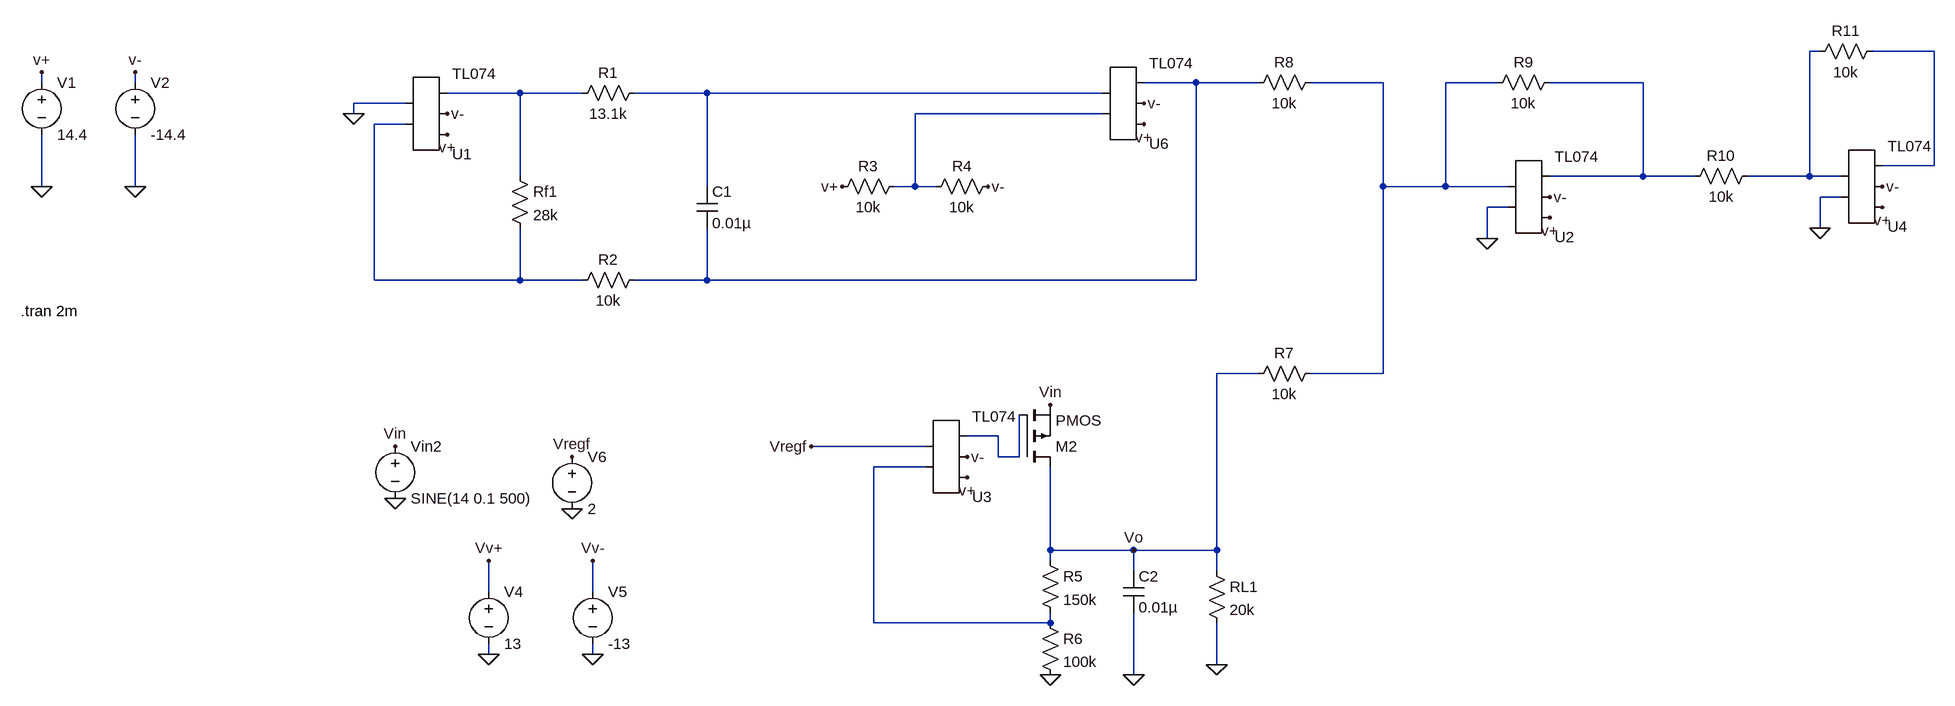
[diagram p0: schematic posible_circuito_gernerador_con_sumador_TL074.asc]
posible_circuito_gernerador_con_sumador_TL074.asc, the LTspice schematic file:
Version 4
SHEET 1 2424 1000
WIRE 1792 0 1776 0
WIRE 1968 0 1872 0
WIRE -944 48 -944 32
WIRE -800 48 -800 32
WIRE 832 48 752 48
WIRE 928 48 832 48
WIRE 1120 48 1008 48
WIRE 1296 48 1216 48
WIRE 1520 48 1376 48
WIRE -208 64 -320 64
WIRE -112 64 -208 64
WIRE 80 64 -32 64
WIRE 688 64 80 64
WIRE -384 80 -464 80
WIRE -464 96 -464 80
WIRE 688 96 400 96
WIRE -384 112 -432 112
WIRE 1968 176 1968 0
WIRE 1968 176 1888 176
WIRE -208 192 -208 64
WIRE 1520 192 1520 48
WIRE 1520 192 1376 192
WIRE 1600 192 1520 192
WIRE 1776 192 1776 0
WIRE 1776 192 1680 192
WIRE 1824 192 1776 192
WIRE -944 208 -944 128
WIRE -800 208 -800 128
WIRE 80 208 80 64
WIRE 400 208 400 96
WIRE 400 208 368 208
WIRE 432 208 400 208
WIRE 1120 208 1120 48
WIRE 1216 208 1216 48
WIRE 1216 208 1120 208
WIRE 1312 208 1216 208
WIRE 1824 224 1792 224
WIRE 1312 240 1280 240
WIRE 1792 272 1792 224
WIRE 1280 288 1280 240
WIRE -432 352 -432 112
WIRE -208 352 -208 272
WIRE -208 352 -432 352
WIRE -112 352 -208 352
WIRE 80 352 80 272
WIRE 80 352 -32 352
WIRE 832 352 832 48
WIRE 832 352 80 352
WIRE 928 496 864 496
WIRE 1120 496 1120 208
WIRE 1120 496 1008 496
WIRE 528 592 480 592
WIRE 416 608 240 608
WIRE 528 624 528 592
WIRE 560 624 560 560
WIRE 560 624 528 624
WIRE 416 640 336 640
WIRE 608 768 608 640
WIRE 736 768 608 768
WIRE 864 768 864 496
WIRE 864 768 736 768
WIRE 608 784 608 768
WIRE 736 800 736 768
WIRE 864 800 864 768
WIRE -256 832 -256 784
WIRE -96 832 -96 784
WIRE 336 880 336 640
WIRE 608 880 608 864
WIRE 608 880 336 880
WIRE -256 928 -256 912
WIRE -96 928 -96 912
WIRE 864 944 864 880
WIRE 736 960 736 864
FLAG 752 112 v+
FLAG 752 80 v-
FLAG -464 96 0
FLAG 288 208 v+
FLAG 512 208 v-
FLAG -944 208 0
FLAG -800 208 0
FLAG -944 32 v+
FLAG -800 32 v-
FLAG 608 544 Vin
FLAG 240 608 Vregf
FLAG 736 960 0
FLAG 608 960 0
FLAG 736 768 Vo
FLAG -256 928 0
FLAG -96 928 0
FLAG -256 784 Vv+
FLAG -96 784 Vv-
FLAG 864 944 0
FLAG -400 608 Vin
FLAG -400 688 0
FLAG -128 624 Vregf
FLAG -128 704 0
FLAG 1376 256 v+
FLAG 1376 224 v-
FLAG 1280 288 0
FLAG 1888 240 v+
FLAG 1888 208 v-
FLAG 1792 272 0
FLAG 480 624 v-
FLAG 480 656 v+
FLAG -320 128 v+
FLAG -320 96 v-
SYMBOL res -224 176 R0
SYMATTR InstName Rf1
SYMATTR Value 28k
SYMBOL res -16 48 R90
WINDOW 0 0 56 VBottom 2
WINDOW 3 32 56 VTop 2
SYMATTR InstName R1
SYMATTR Value 13.1k
SYMBOL res -16 336 R90
WINDOW 0 0 56 VBottom 2
WINDOW 3 32 56 VTop 2
SYMATTR InstName R2
SYMATTR Value 10k
SYMBOL cap 64 208 R0
SYMATTR InstName C1
SYMATTR Value 0.01µ
SYMBOL res 384 192 R90
WINDOW 0 0 56 VBottom 2
WINDOW 3 32 56 VTop 2
SYMATTR InstName R3
SYMATTR Value 10k
SYMBOL res 528 192 R90
WINDOW 0 0 56 VBottom 2
WINDOW 3 32 56 VTop 2
SYMATTR InstName R4
SYMATTR Value 10k
SYMBOL voltage -944 32 R0
WINDOW 123 0 0 Left 2
WINDOW 39 0 0 Left 2
SYMATTR InstName V1
SYMATTR Value 14.4
SYMBOL voltage -800 32 R0
WINDOW 123 0 0 Left 2
WINDOW 39 0 0 Left 2
SYMATTR InstName V2
SYMATTR Value -14.4
SYMBOL cap 720 800 R0
SYMATTR InstName C2
SYMATTR Value 0.01µ
SYMBOL res 592 768 R0
SYMATTR InstName R5
SYMATTR Value 150k
SYMBOL res 592 864 R0
SYMATTR InstName R6
SYMATTR Value 100k
SYMBOL voltage -256 816 R0
WINDOW 123 0 0 Left 2
WINDOW 39 0 0 Left 2
SYMATTR InstName V4
SYMATTR Value 13
SYMBOL voltage -96 816 R0
WINDOW 123 0 0 Left 2
WINDOW 39 0 0 Left 2
SYMATTR InstName V5
SYMATTR Value -13
SYMBOL pmos 560 640 M180
SYMATTR InstName M2
SYMBOL res 848 784 R0
SYMATTR InstName RL1
SYMATTR Value 20k
SYMBOL voltage -400 592 R0
WINDOW 123 0 0 Left 2
WINDOW 39 0 0 Left 2
SYMATTR InstName Vin2
SYMATTR Value SINE(14 0.1 500)
SYMBOL voltage -128 608 R0
WINDOW 123 0 0 Left 2
WINDOW 39 0 0 Left 2
SYMATTR InstName V6
SYMATTR Value 2
SYMBOL res 1024 480 R90
WINDOW 0 0 56 VBottom 2
WINDOW 3 32 56 VTop 2
SYMATTR InstName R7
SYMATTR Value 10k
SYMBOL res 1024 32 R90
WINDOW 0 0 56 VBottom 2
WINDOW 3 32 56 VTop 2
SYMATTR InstName R8
SYMATTR Value 10k
SYMBOL res 1392 32 R90
WINDOW 0 0 56 VBottom 2
WINDOW 3 32 56 VTop 2
SYMATTR InstName R9
SYMATTR Value 10k
SYMBOL res 1696 176 R90
WINDOW 0 0 56 VBottom 2
WINDOW 3 32 56 VTop 2
SYMATTR InstName R10
SYMATTR Value 10k
SYMBOL res 1888 -16 R90
WINDOW 0 0 56 VBottom 2
WINDOW 3 32 56 VTop 2
SYMATTR InstName R11
SYMATTR Value 10k
SYMBOL AutoGenerated/TL074 720 80 M180
SYMATTR InstName U6
SYMBOL AutoGenerated/TL074 1344 224 M180
SYMATTR InstName U2
SYMBOL AutoGenerated/TL074 1856 208 M180
SYMATTR InstName U4
SYMBOL AutoGenerated/TL074 448 624 M180
SYMATTR InstName U3
SYMBOL AutoGenerated/TL074 -352 96 M180
SYMATTR InstName U1
TEXT -976 400 Left 2 !.tran 2m

The netlist it stands for:
* posible_circuito_gernerador_con_sumador_TL074.asc
Rf1 N006 N009 28k
R1 N007 N006 13.1k
R2 N003 N009 10k
C1 N007 N003 0.01µ
R3 N008 v+ 10k
R4 v- N008 10k
V1 v+ 0 14.4
V2 v- 0 -14.4
C2 Vo 0 0.01µ
R5 Vo N011 150k
R6 N011 0 100k
V4 Vv+ 0 13
V5 Vv- 0 -13
M2 Vo N010 Vin Vin PMOS
RL1 Vo 0 20k
Vin2 Vin 0 SINE(14 0.1 500)
V6 Vregf 0 2
R7 N004 Vo 10k
R8 N004 N003 10k
R9 N005 N004 10k
R10 N001 N005 10k
R11 N002 N001 10k
* U6: TL074 (symbol AutoGenerated/TL074 not available, pins judged from their places): pin1=N008 pin2=N007 pin3=v+ pin4=v- pin5=N003
* U2: TL074 (symbol AutoGenerated/TL074 not available, pins judged from their places): pin1=0 pin2=N004 pin3=v+ pin4=v- pin5=N005
* U4: TL074 (symbol AutoGenerated/TL074 not available, pins judged from their places): pin1=0 pin2=N001 pin3=v+ pin4=v- pin5=N002
* U3: TL074 (symbol AutoGenerated/TL074 not available, pins judged from their places): pin1=N011 pin2=Vregf pin3=v+ pin4=v- pin5=N010
* U1: TL074 (symbol AutoGenerated/TL074 not available, pins judged from their places): pin1=N009 pin2=0 pin3=v+ pin4=v- pin5=N006
.model NMOS NMOS
.model PMOS PMOS
.lib standard.mos
.tran 2m
.backanno
.end